# EAGLE design ignition4 (EAGLE 7.2.0)
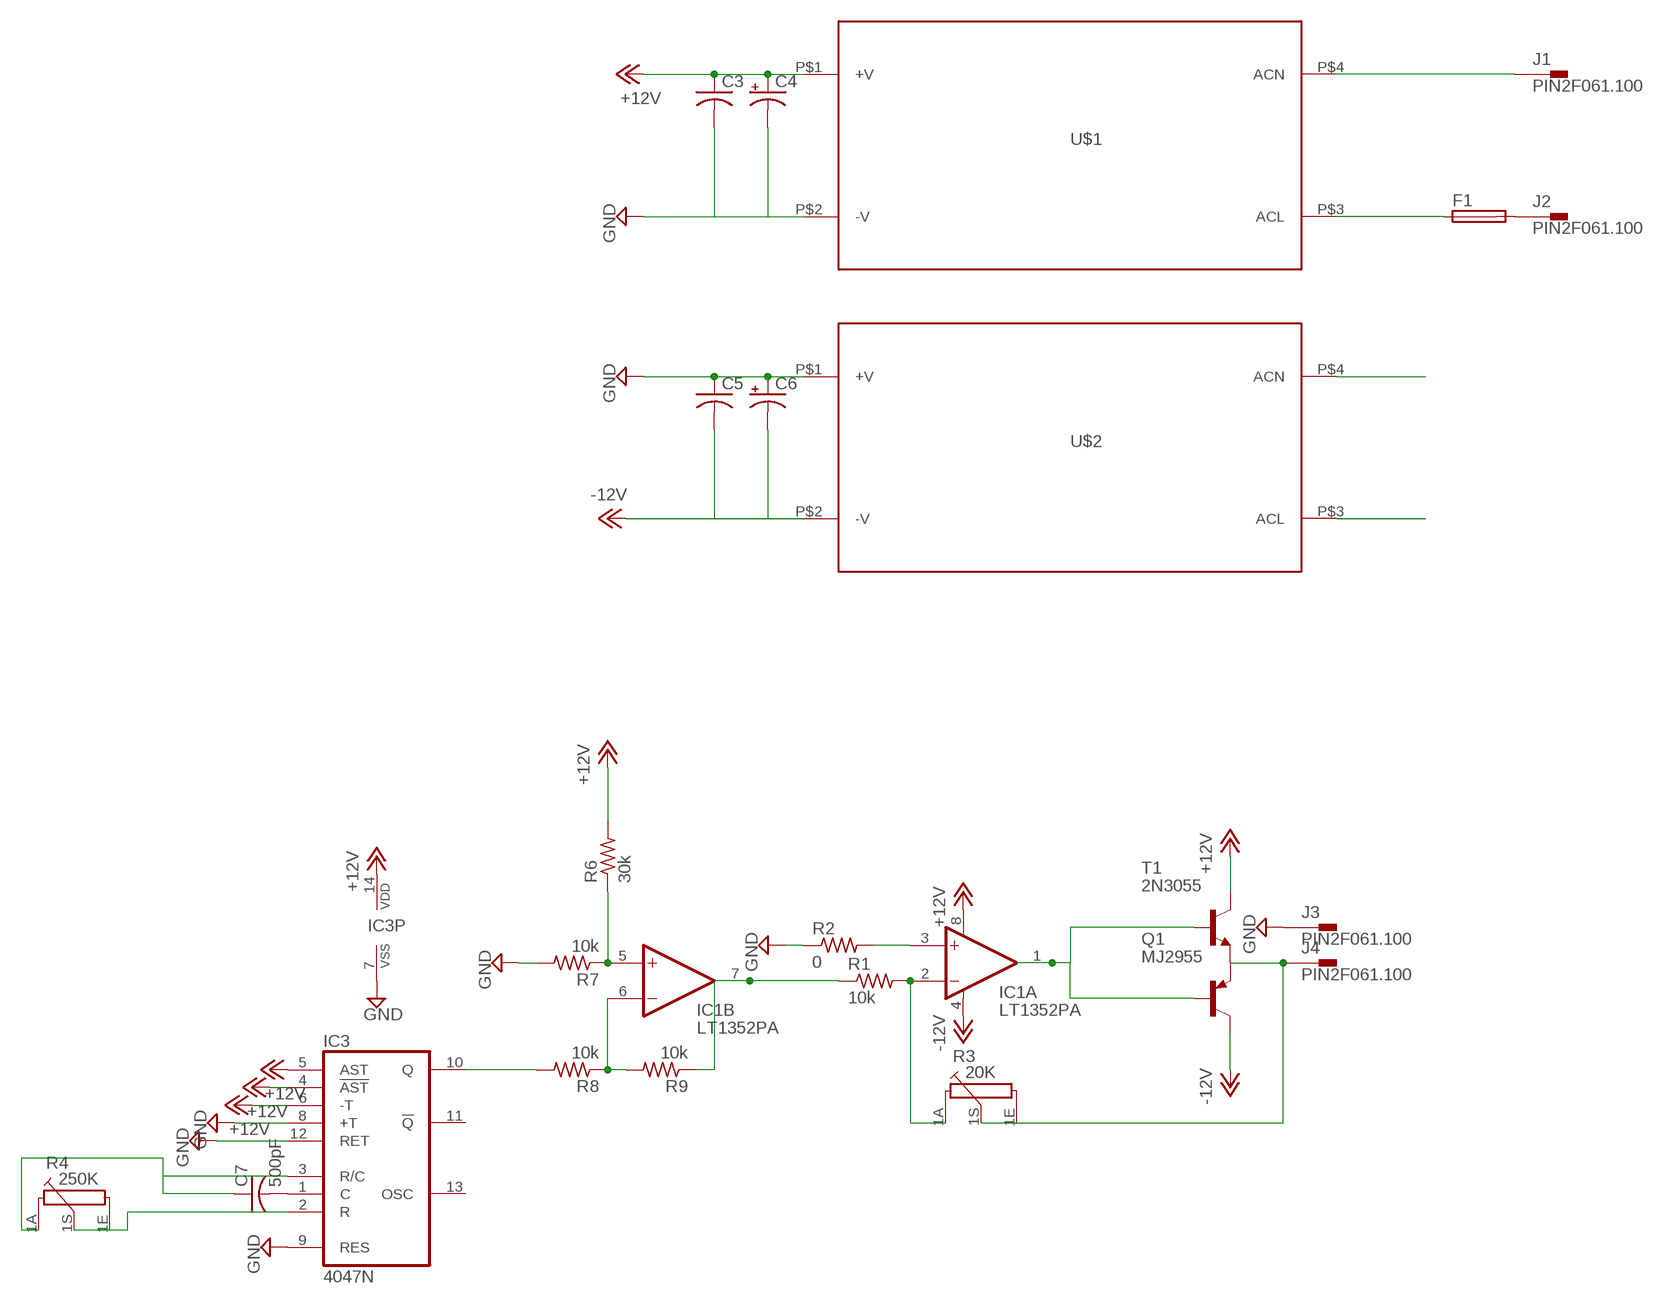
[diagram p0: schematic, sheet 1]

## Parts
C3  C-US050-035X075  [C050-035X075]
C4  CPOL-USE5-5  [E5-5]
C5  C-US050-035X075  [C050-035X075]
C6  CPOL-USE5-5  [E5-5]
C7  500pF  C-US075-042X103  [C075-042X103]
F1  SH25  [SH25]
IC1  LT1352PA  [DIL08]
IC3  4047N  [DIL14]
J1  PIN2F061.100  [F061.100]
J2  PIN2F061.100  [F061.100]
J3  PIN2F061.100  [F061.100]
J4  PIN2F061.100  [F061.100]
Q1  MJ2955  [TO3]
R1  10k  R-US_0207/15  [0207/15]
R2  0  R-US_0207/15  [0207/15]
R3  20K  PC16S  [PC16S]
R4  250K  PC16S  [PC16S]
R6  30k  R-US_0207/12  [0207/12]
R7  10k  R-US_0207/10  [0207/10]
R8  10k  R-US_0207/10  [0207/10]
R9  10k  R-US_0207/10  [0207/10]
T1  2N3055  [TO3]
U$1  IRM-60-12  [IRM-60-12]
U$2  IRM-60-12  [IRM-60-12]

## Nets
+12V: C3.1 C4.+ IC1.8(A:V+) IC3.4(!AST) IC3.5(AST) IC3.6(-T) IC3.14(VDD) R6.2 T1.C T1.C/(C) U$1.P$1(+V)
-12V: C5.2 C6.- IC1.4(A:V-) Q1.C Q1.C/(C) U$2.P$2(-V)
GND: C3.2 C4.- C5.1 C6.+ IC3.7(VSS) IC3.8(+T) IC3.9(RES) IC3.12(RET) J3.A1 J3.A2 R2.1 R7.2 U$1.P$2(-V) U$2.P$1(+V)
L: F1.1 U$1.P$3(ACL) U$2.P$3(ACL)
N: J1.A1 J1.A2 U$1.P$4(ACN) U$2.P$4(ACN)
N$1: IC1.2(A:-IN) R1.2 R3.1A
N$3: J4.A1 J4.A2 Q1.E R3.1E R3.1S T1.E
N$4: IC1.7(B:OUT) R1.1 R9.1
N$5: F1.2 J2.A1 J2.A2
N$6: IC1.1(A:OUT) Q1.B T1.B
N$9: IC1.3(A:+IN) R2.2
N$10: IC1.5(B:+IN) R6.1 R7.1
N$11: IC1.6(B:-IN) R8.1 R9.2
N$12: IC3.10(Q) R8.2
N$13: C7.2 IC3.1(C)
N$14: IC3.2(R) R4.1E R4.1S
N$15: C7.1 IC3.3(R/C) R4.1A
Unconnected: IC3.11(!Q) IC3.13(OSC)

## Library data of the parts
C3 C5 C7 = rcl:C-US: CAPACITOR, American symbol
C4 C6 = rcl:CPOL-US: POLARIZED CAPACITOR, American symbol
F1 = fuse:SH25: FUSE HOLDER grid 25 mm, OGN0031 8211, Schurter (Buerklin); MF: SCHURTER; MPN: 0031.8211; OC_FARNELL: 1162741; OC_NEWARK: 96B9380
IC1 = linear-technology:LT1352: Dual Operational Amplifiers Source: http://datasheets.maxim-ic.com/en/ds/ICL7612-ICL764X.pdf; OC_FARNELL: unknown; OC_NEWARK: unknown
IC3 = 40xx:4047: LP monostable/astable MULTIVIBRATOR
J1-J4 = con-faston:PIN2: Flachstecker Typ Tyco/Electronics/AMP TAB, FASTON Printed Circuit Board Tabs Source: http://www.buerklin.com, http://catalog.tycoelectronics.com; OC_FARNELL: unknown; OC_NEWARK: unknown
Q1 = transistor-pnp:MJ2955: PNP Transistor
R1 R2 R6-R9 = resistor:R-US_: RESISTOR, American symbol
R3 R4 = piher:PC16S: POTENTIOMETER single carbon potentiometer, 16 mm, S3ROH; OC_FARNELL: 4452940; OC_NEWARK: unknown
T1 = transistor:2N3055: NPN TRANSISTOR
U$1 U$2 = meanwell:IRM-60-12

## Board
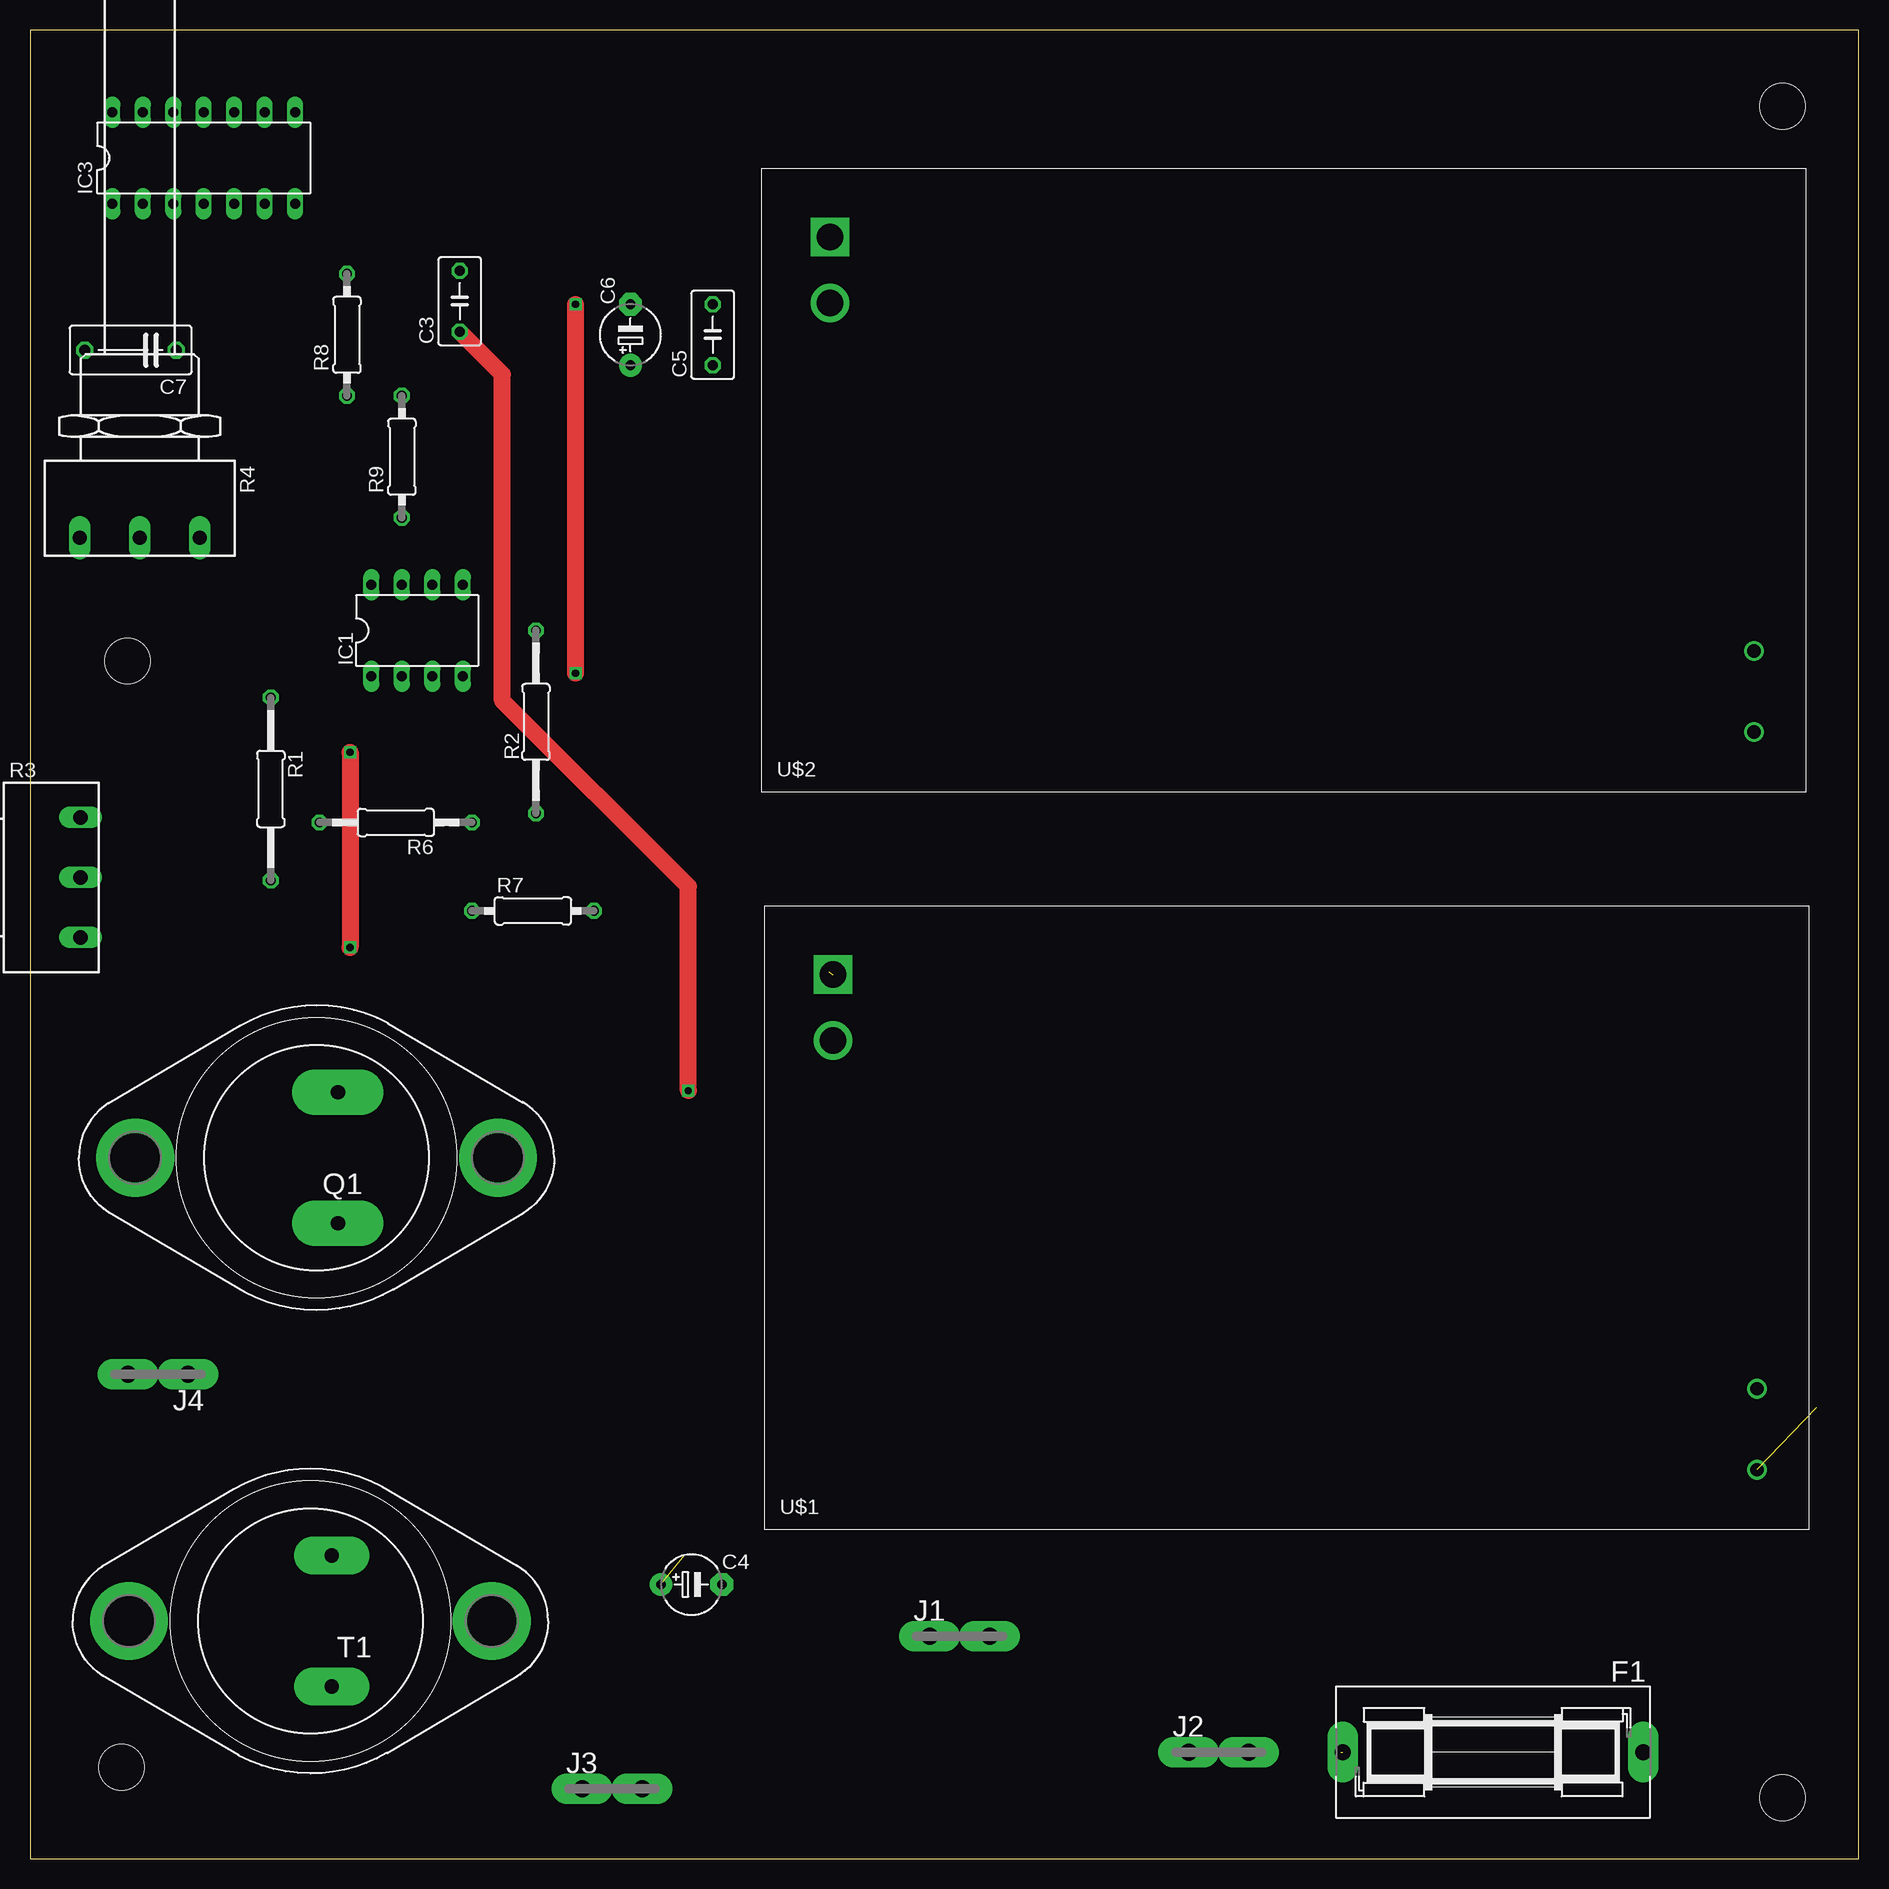
[diagram p1: board, top side]
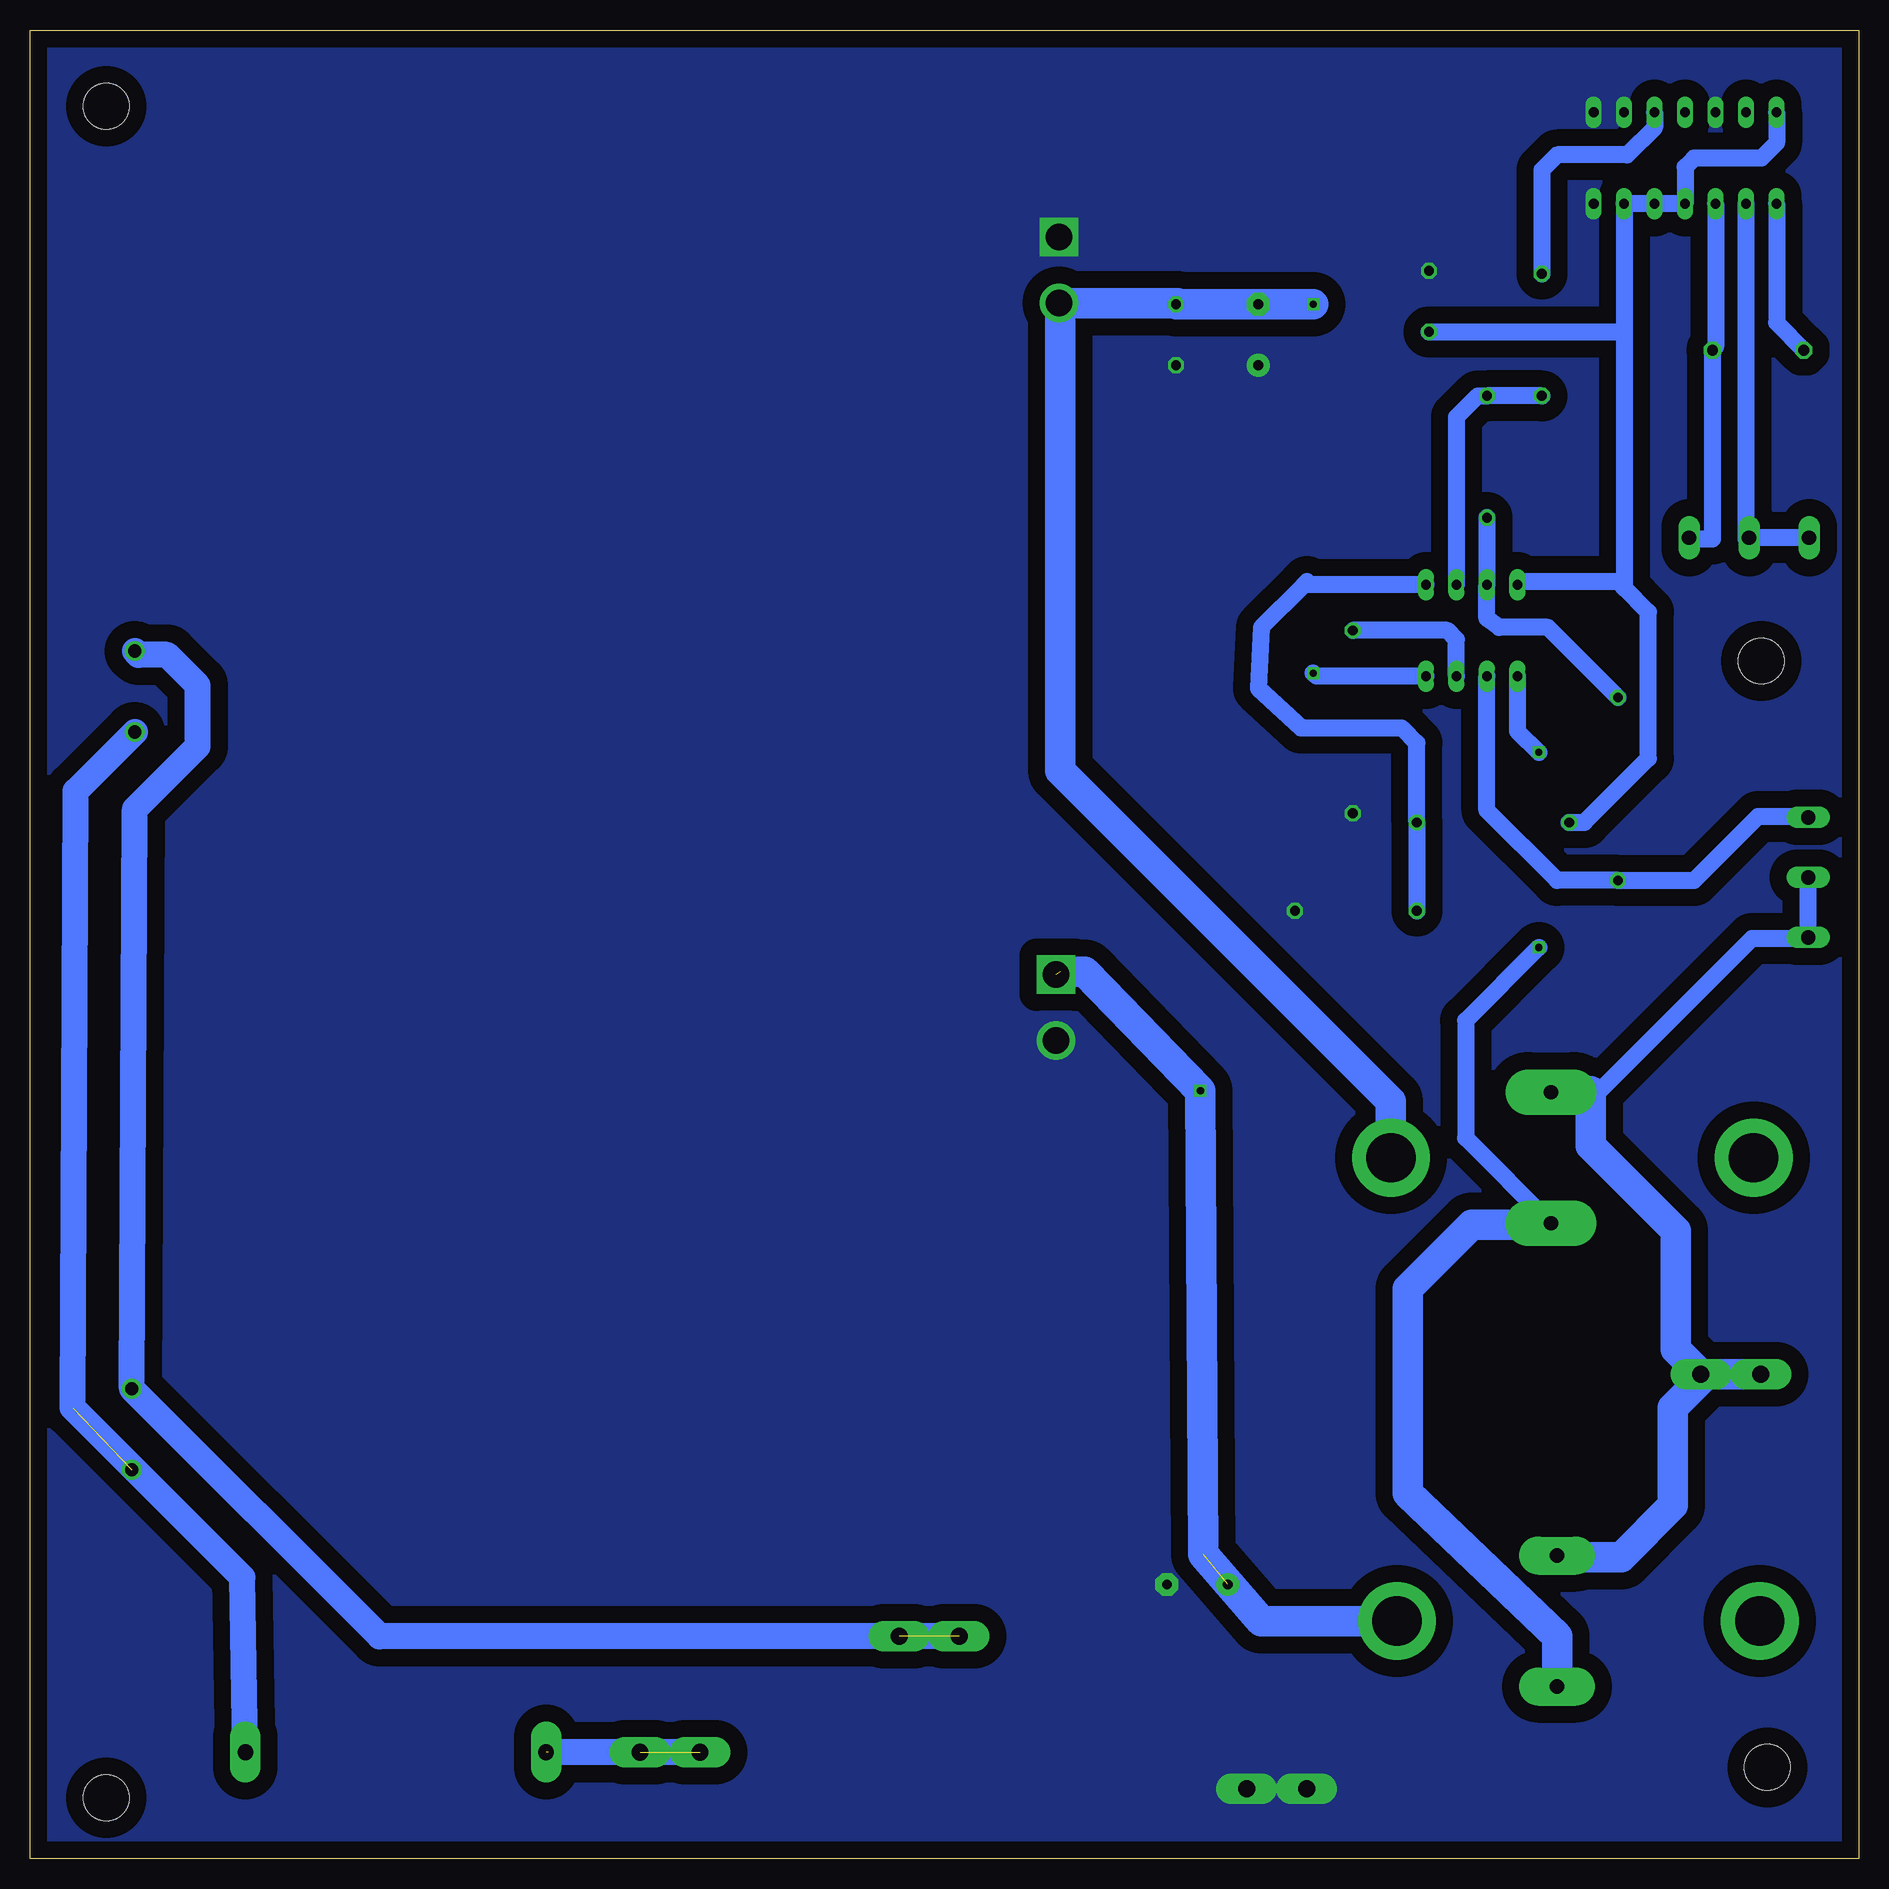
[diagram p2: board, bottom side, seen from below]

Size 152.4 x 152.4 mm. Coordinates in mm from the lower left corner, seen from the top.
Outline: 0,0 152.4,0 152.4,152.4 0,152.4 0,0
Copper layers (1*16): Top 0.035mm / dielectric 1.5mm / Bottom 0.035mm
Design rules "default": minimum track width 10mil, minimum drill 24mil, track to track 8mil, track to pad 8mil, pad to pad 8mil, via to via 8mil, smd to smd 8mil, copper to edge 40mil, drill to drill 8mil, minimum pad ring 10mil, minimum via ring 8mil, stop-mask expansion 4mil, vias tented up to drill 0mil, thermal gap 10mil
Holes 3.8 mm at 146.05,5.08 7.62,7.62 146.05,146.05 8.13,99.82

### Footprints (pad centres in the part's own frame; a part is rotated, then mirrored left to right if it is on the bottom)
C050-035X075 = drill 0.813 octagon: 1 -2.54,0; 2 2.54,0
E5-5 = drill 0.813 pad 1.905: + -2.54,0 | drill 0.813 pad 1.905 octagon: - 2.54,0
C075-042X103 = drill 0.914 octagon: 1 -3.81,0; 2 3.81,0
SH25 = drill 1.321 pad 2.54 long: 1 -12.522,0; 2 12.522,0
DIL08 = drill 0.813 long: 1 -3.81,-3.81; 2 -1.27,-3.81; 3 1.27,-3.81; 4 3.81,-3.81; 5 3.81,3.81; 6 1.27,3.81; 7 -1.27,3.81; 8 -3.81,3.81
DIL14 = drill 0.813 long: 1 -7.62,-3.81; 2 -5.08,-3.81; 3 -2.54,-3.81; 4 0,-3.81; 5 2.54,-3.81; 6 5.08,-3.81; 7 7.62,-3.81; 8 7.62,3.81; 9 5.08,3.81; 10 2.54,3.81; 11 0,3.81; 12 -2.54,3.81; 13 -5.08,3.81; 14 -7.62,3.81
F061.100 = drill 1.4 pad 2.54 long: A1 -2.5,0; A2 2.5,0
TO3 = drill 1.194 pad 3.81 long: B -1.778,5.461; E -1.778,-5.461 | drill 4.115 pad 6.477: C 15.113,0; C/ -15.113,0
0207/15 = drill 0.813 octagon: 1 -7.62,0; 2 7.62,0
PC16S = drill 1.2 long: 1A -5,6.5; 1E 5,6.5; 1S 0,6.5
0207/12 = drill 0.813 octagon: 1 -6.35,0; 2 6.35,0
0207/10 = drill 0.813 octagon: 1 -5.08,0; 2 5.08,0
TO3' = drill 1.194 pad 3.15 long: B -1.778,5.461; E -1.778,-5.461 | drill 4.115 pad 6.477: C 15.113,0; C/ -15.113,0
IRM-60-12 = drill 2.2 square: P$1 5.7,46.25 | drill 2.2: P$2 5.7,40.75 | drill 1.1: P$3 82.7,5; P$4 82.7,11.75

### Placement (x,y rotation side)
C3  35.81,129.79 90 top
C4  55.12,22.86 0 top
C5  56.9,127 90 top
C6  50.04,127 90 top
C7  8.38,125.73 180 top
F1  121.92,8.89 180 top
IC1  32.26,102.36 0 top
IC3  14.48,141.73 0 top
J1  77.47,18.54 0 top
J2  99.06,8.89 0 top
J3  48.51,5.84 0 top
J4  10.67,40.39 180 top
Q1  23.88,58.42 180 top
R1  20.07,89.15 270 top
R2  42.16,94.74 90 top
R3  -2.29,81.79 270 top
R4  9.14,116.59 180 top
R6  30.48,86.36 180 top
R7  41.91,78.99 0 top
R8  26.42,127 90 top
R9  30.99,116.84 90 top
T1  2N3055  [TO3']  23.37,19.81 180 top
U$1  61.21,27.43 0 top
U$2  60.96,88.9 0 top

### Tracks (layer width: path | path; a pad name or v marks a point on that pad's centre or on a via)
+12V  (via drill 0.6)  (2 unrouted)
  Top 1.422: v54.86,64.01 54.86,81.03 39.37,96.52 39.37,123.7 C3.1
  Bottom 1.422: 19.56,105.92 17.53,103.89 17.53,91.69 22.86,86.36 R6.2 | 19.56,105.92 20.07,106.43 28.19,106.43 IC1.8 | IC3.14 6.86,143 8.13,141.73 13.72,141.73 14.48,140.97 IC3.4 IC3.5 IC3.6 19.56,127.25 | 19.56,127.25 19.56,105.92 | C3.1 19.56,127.25
  Bottom 2.54: T1.C/ 49.78,19.81 54.61,25.4 v54.86,64.01 64.52,73.91 66.55,73.91 66.29,73.66
-12V  (via drill 0.6)
  Top 1.422: v45.47,98.81 v45.47,129.54
  Bottom 1.422: IC1.4 45.21,98.55 v45.47,98.81
  Bottom 2.54: v45.47,129.54 C6.- C5.2 56.75,129.65 U$2.P$2 66.55,129.54 66.55,90.68 38.99,63.12 Q1.C/
GND
  pour Bottom (isolate 1.422, no thermals): 0,152.65 152.91,152.65 152.91,0 0,0
L  (1 unrouted)
  Bottom 2.184: U$2.P$3 148.59,88.97 148.84,37.59 134.7,23.44 F1.1
N  (1 unrouted)
  Bottom 2.184: J1.A1 123.27,18.54 U$1.P$4 143.66,87.48 138.43,92.71 138.43,97.79 140.97,100.33 143.34,100.33 U$2.P$4
N$1
  Bottom 1.422: R3.1A 4.29,86.87 8.38,86.87 13.72,81.53 R1.2 25.15,81.53 30.99,87.38 IC1.2
N$3
  Bottom 1.422: Q1.E 21.72,63.88 8.89,76.71 4.29,76.71 R3.1E R3.1S
  Bottom 2.54: Q1.E 22.35,63.97 22.35,59.44 15.24,52.32 15.24,42.46 J4.A1 | 8.13,40.39 J4.A2 J4.A1 | T1.E 24.77,25.15 19.81,25.15 15.49,29.46 15.49,37.59 13.17,39.92 J4.A1
N$4
  Bottom 1.422: R1.1 25.91,102.62 29.97,102.62 30.99,103.38 IC1.7 R9.1
N$5  (2 unrouted)
  Bottom 2.184: J2.A1 109.22,8.89
N$6  (via drill 0.6)
  Top 1.422: v26.67,92.2 v26.67,75.95
  Bottom 1.422: v26.67,92.2 28.45,93.98 IC1.1 | v26.67,75.95 32.77,69.85 32.77,60.07 Q1.B
  Bottom 2.54: T1.B 25.15,18.54 37.59,30.48 37.59,47.5 32.26,52.83 25.78,52.83 Q1.B
N$9
  Bottom 1.422: R2.2 34.29,102.36 33.53,101.6 IC1.3
N$10
  Bottom 1.422: R7.1 R6.1 36.83,92.96 38.1,94.23 46.48,94.23 50.04,97.54 49.78,102.62 46.35,106.05 46.23,106.17 | 45.97,106.43 46.23,106.17 | IC1.5 46.23,106.17
N$11
  Bottom 1.422: R8.1 R9.2 31.75,121.92 33.53,120.14 IC1.6
N$12
  Bottom 1.422: IC3.10 17.02,144.27 19.3,141.99 25.15,141.99 26.42,140.72 R8.2
N$13
  Bottom 1.422: IC3.1 6.86,128.02 C7.2
N$14
  Bottom 1.422: R4.1E R4.1S 9.4,109.98 IC3.2
N$15
  Bottom 1.422: IC3.3 11.94,125.98 C7.1 12.19,109.98 14.04,109.98 R4.1A